# Altium schematic sheet Indicate.SchDoc
size A4; SheetNumber: 5; SheetTotal: 7
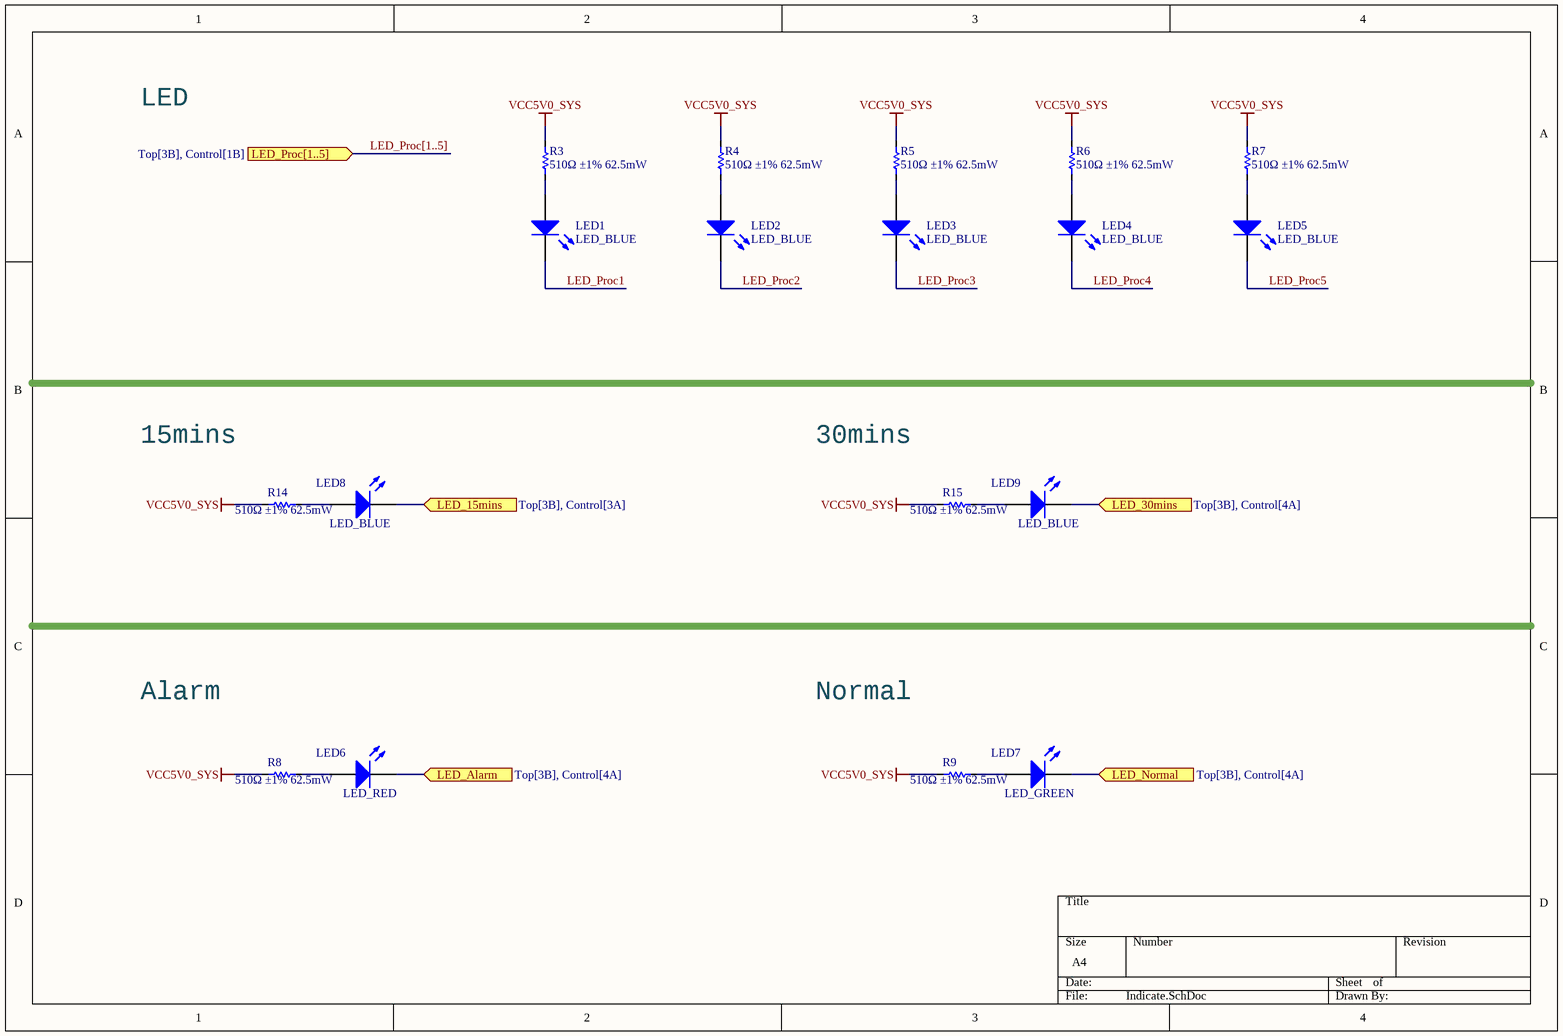
[diagram p0: Indicate.SchDoc]

## Parts
LED1  LED_BLUE  [LED0603]
LED2  LED_BLUE  [LED0603]
LED3  LED_BLUE  [LED0603]
LED4  LED_BLUE  [LED0603]
LED5  LED_BLUE  [LED0603]
LED6  LED_RED  [LED0603]
LED7  LED_GREEN  [LED0603]
LED8  LED_BLUE  [LED0603]
LED9  LED_BLUE  [LED0603]
R3  510Ω ±1% 62.5mW  [R0402]
R4  510Ω ±1% 62.5mW  [R0402]
R5  510Ω ±1% 62.5mW  [R0402]
R6  510Ω ±1% 62.5mW  [R0402]
R7  510Ω ±1% 62.5mW  [R0402]
R8  510Ω ±1% 62.5mW  [R0402]
R9  510Ω ±1% 62.5mW  [R0402]
R14  510Ω ±1% 62.5mW  [R0402]
R15  510Ω ±1% 62.5mW  [R0402]

## Ports
LED_15mins (in, see Top[3B], Control[3A]), LED_30mins (in, see Top[3B], Control[4A]), LED_Alarm (in, see Top[3B], Control[4A]), LED_Normal (in, see Top[3B], Control[4A]), LED_Proc[1..5] (in, see Top[3B], Control[1B])

## Nets
VCC5V0_SYS: R3.2 R4.2 R5.2 R6.2 R7.2 R8.1 R9.1 R14.1 R15.1
LED_15mins: LED8.2(K) ; port LED_15mins
LED_30mins: LED9.2(K) ; port LED_30mins
LED_Alarm: LED6.2(K) ; port LED_Alarm
LED_Normal: LED7.2(K) ; port LED_Normal
LED_Proc1: LED1.2(K)
LED_Proc2: LED2.2(K)
LED_Proc3: LED3.2(K)
LED_Proc4: LED4.2(K)
LED_Proc5: LED5.2(K)
NetLED1_1: LED1.1(A) R3.1
NetLED2_1: LED2.1(A) R4.1
NetLED3_1: LED3.1(A) R5.1
NetLED4_1: LED4.1(A) R6.1
NetLED5_1: LED5.1(A) R7.1
NetLED6_1: LED6.1(A) R8.2
NetLED7_1: LED7.1(A) R9.2
NetLED8_1: LED8.1(A) R14.2
NetLED9_1: LED9.1(A) R15.2

## Buses and harness runs
bus LED_Proc[1..5] = port LED_Proc[1..5]

## Notes on the sheet
- LED
- 15mins
- 30mins
- Alarm
- Normal

## Library data of the parts
LED1-LED5 LED8 LED9 = LED2: XL-1608UBC-04; Published: 8-Jun-2000; LatestRevisionDate: 17-Jul-2002; LatestRevisionNote: Re-released for DXP Platform.; PackageVersion: Feb-2002; PackageReference: 3.2X1.6X1.1; Publisher: Altium Limited; PackageDescription: SM LED; 2 Flat Leads
LED6 = LED2: XL-1608SURC-06; Published: 8-Jun-2000; LatestRevisionDate: 17-Jul-2002; LatestRevisionNote: Re-released for DXP Platform.; PackageVersion: Feb-2002; PackageReference: 3.2X1.6X1.1; Publisher: Altium Limited; PackageDescription: SM LED; 2 Flat Leads
LED7 = LED2: XL-1608PGC-06; Published: 8-Jun-2000; LatestRevisionDate: 17-Jul-2002; LatestRevisionNote: Re-released for DXP Platform.; PackageVersion: Feb-2002; PackageReference: 3.2X1.6X1.1; Publisher: Altium Limited; PackageDescription: SM LED; 2 Flat Leads
R3-R9 R14 R15 = R0402: 0402WGF5100TCE; Published: 8-Jun-2000; LatestRevisionDate: 17-Jul-2002; LatestRevisionNote: Re-released for DXP Platform.; PackageReference: AXIAL-0.3; Publisher: Altium Limited; PackageDescription: Axial Device, Thru-Hole; 2 Leads; 0.3 in Pin Spacing